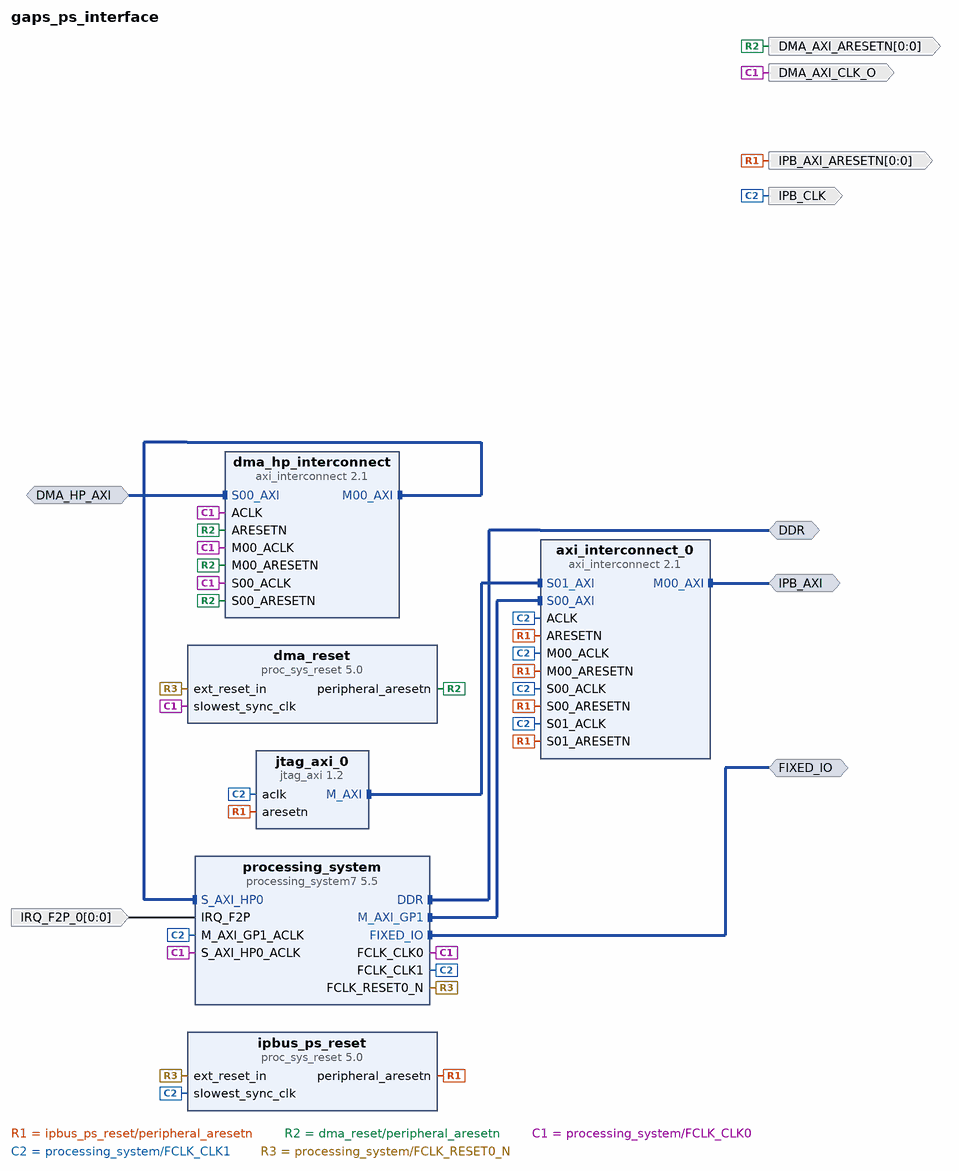
[diagram p0: block diagram of the top level]
# Vivado block design gaps_ps_interface, xc7z010clg400-1, Vivado 2020.1_AR75210
create_bd_design gaps_ps_interface

create_bd_intf_port -mode Master -vlnv xilinx.com:interface:ddrx_rtl:1.0 DDR
create_bd_intf_port -mode Slave -vlnv xilinx.com:interface:aximm_rtl:1.0 DMA_HP_AXI
set_property -dict [list \
  CONFIG.DATA_WIDTH 32 \
  CONFIG.PROTOCOL AXI4 \
  CONFIG.ID_WIDTH 6 \
  CONFIG.ADDR_WIDTH 32 \
  CONFIG.AWUSER_WIDTH 0 \
  CONFIG.ARUSER_WIDTH 0 \
  CONFIG.WUSER_WIDTH 0 \
  CONFIG.RUSER_WIDTH 0 \
  CONFIG.BUSER_WIDTH 0 \
  CONFIG.READ_WRITE_MODE READ_WRITE \
  CONFIG.HAS_BURST 1 \
  CONFIG.HAS_LOCK 1 \
  CONFIG.HAS_PROT 1 \
  CONFIG.HAS_CACHE 1 \
  CONFIG.HAS_QOS 1 \
  CONFIG.HAS_REGION 0 \
  CONFIG.HAS_WSTRB 1 \
  CONFIG.HAS_BRESP 1 \
  CONFIG.HAS_RRESP 1 \
  CONFIG.SUPPORTS_NARROW_BURST 0 \
  CONFIG.NUM_READ_OUTSTANDING 8 \
  CONFIG.NUM_WRITE_OUTSTANDING 8 \
  CONFIG.MAX_BURST_LENGTH 256 \
  CONFIG.NUM_READ_THREADS 1 \
  CONFIG.NUM_WRITE_THREADS 1 \
  CONFIG.RUSER_BITS_PER_BYTE 0 \
  CONFIG.WUSER_BITS_PER_BYTE 0 \
] [get_bd_intf_ports DMA_HP_AXI]
create_bd_intf_port -mode Master -vlnv xilinx.com:display_processing_system7:fixedio_rtl:1.0 FIXED_IO
create_bd_intf_port -mode Master -vlnv xilinx.com:interface:aximm_rtl:1.0 IPB_AXI
set_property -dict [list \
  CONFIG.DATA_WIDTH 32 \
  CONFIG.PROTOCOL AXI4LITE \
  CONFIG.ADDR_WIDTH 32 \
  CONFIG.HAS_BURST 0 \
  CONFIG.HAS_LOCK 0 \
  CONFIG.HAS_CACHE 0 \
  CONFIG.HAS_QOS 0 \
  CONFIG.HAS_REGION 0 \
  CONFIG.NUM_READ_OUTSTANDING 0 \
  CONFIG.NUM_WRITE_OUTSTANDING 0 \
] [get_bd_intf_ports IPB_AXI]
create_bd_port -dir O -from 0 -to 0 DMA_AXI_ARESETN
create_bd_port -dir O -type clk DMA_AXI_CLK_O
set_property -dict {CONFIG.ASSOCIATED_BUSIF DMA_HP_AXI} [get_bd_ports DMA_AXI_CLK_O]
create_bd_port -dir O -from 0 -to 0 -type rst IPB_AXI_ARESETN
create_bd_port -dir I -from 0 -to 0 -type intr IRQ_F2P_0
set_property -dict {CONFIG.PortWidth 1} [get_bd_ports IRQ_F2P_0]
create_bd_port -dir O -type clk IPB_CLK
set_property -dict {CONFIG.ASSOCIATED_BUSIF IPB_AXI CONFIG.ASSOCIATED_RESET IPB_AXI_ARESETN} [get_bd_ports IPB_CLK]

create_bd_cell -type ip -vlnv xilinx.com:ip:proc_sys_reset:5.0 dma_reset
create_bd_cell -type ip -vlnv xilinx.com:ip:proc_sys_reset:5.0 ipbus_ps_reset
create_bd_cell -type ip -vlnv xilinx.com:ip:processing_system7:5.5 processing_system
set_property -dict [list \
  CONFIG.PCW_APU_PERIPHERAL_FREQMHZ 666.666666 \
  CONFIG.PCW_CRYSTAL_PERIPHERAL_FREQMHZ 33.333333333333333333333333333333333 \
  CONFIG.PCW_ENET0_ENET0_IO {MIO 16 .. 27} \
  CONFIG.PCW_ENET0_GRP_MDIO_ENABLE 1 \
  CONFIG.PCW_ENET0_GRP_MDIO_IO {MIO 52 .. 53} \
  CONFIG.PCW_ENET0_PERIPHERAL_ENABLE 1 \
  CONFIG.PCW_ENET_RESET_ENABLE 0 \
  CONFIG.PCW_EN_CLK1_PORT 1 \
  CONFIG.PCW_FCLK_CLK1_BUF TRUE \
  CONFIG.PCW_FPGA0_PERIPHERAL_FREQMHZ 100 \
  CONFIG.PCW_FPGA1_PERIPHERAL_FREQMHZ 33.33333333333333333333333333333 \
  CONFIG.PCW_FPGA_FCLK1_ENABLE 1 \
  CONFIG.PCW_GP0_EN_MODIFIABLE_TXN 0 \
  CONFIG.PCW_GP1_EN_MODIFIABLE_TXN 0 \
  CONFIG.PCW_GPIO_MIO_GPIO_ENABLE 1 \
  CONFIG.PCW_GPIO_MIO_GPIO_IO MIO \
  CONFIG.PCW_I2C0_GRP_INT_ENABLE 1 \
  CONFIG.PCW_I2C0_GRP_INT_IO EMIO \
  CONFIG.PCW_I2C0_I2C0_IO {MIO 14 .. 15} \
  CONFIG.PCW_I2C0_PERIPHERAL_ENABLE 1 \
  CONFIG.PCW_I2C_PERIPHERAL_FREQMHZ 111.111115 \
  CONFIG.PCW_I2C_RESET_ENABLE 0 \
  CONFIG.PCW_IRQ_F2P_INTR 1 \
  CONFIG.PCW_PERIPHERAL_BOARD_PRESET None \
  CONFIG.PCW_PRESET_BANK0_VOLTAGE {LVCMOS 1.8V} \
  CONFIG.PCW_PRESET_BANK1_VOLTAGE {LVCMOS 1.8V} \
  CONFIG.PCW_QSPI_GRP_FBCLK_ENABLE 1 \
  CONFIG.PCW_QSPI_GRP_FBCLK_IO {MIO 8} \
  CONFIG.PCW_QSPI_GRP_SINGLE_SS_ENABLE 1 \
  CONFIG.PCW_QSPI_GRP_SINGLE_SS_IO {MIO 1 .. 6} \
  CONFIG.PCW_QSPI_PERIPHERAL_ENABLE 1 \
  CONFIG.PCW_QSPI_PERIPHERAL_FREQMHZ 125 \
  CONFIG.PCW_QSPI_QSPI_IO {MIO 1 .. 6} \
  CONFIG.PCW_SD0_GRP_CD_ENABLE 0 \
  CONFIG.PCW_SD0_GRP_WP_ENABLE 0 \
  CONFIG.PCW_SD0_PERIPHERAL_ENABLE 1 \
  CONFIG.PCW_SD0_SD0_IO {MIO 40 .. 45} \
  CONFIG.PCW_SDIO_PERIPHERAL_FREQMHZ 33.333333333333 \
  CONFIG.PCW_SINGLE_QSPI_DATA_MODE x4 \
  CONFIG.PCW_S_AXI_HP0_DATA_WIDTH 32 \
  CONFIG.PCW_TTC0_PERIPHERAL_ENABLE 1 \
  CONFIG.PCW_TTC0_TTC0_IO {MIO 30 .. 31} \
  CONFIG.PCW_UART0_PERIPHERAL_ENABLE 1 \
  CONFIG.PCW_UART0_UART0_IO {MIO 46 .. 47} \
  CONFIG.PCW_UART1_PERIPHERAL_ENABLE 0 \
  CONFIG.PCW_UART_PERIPHERAL_FREQMHZ 100 \
  CONFIG.PCW_UIPARAM_DDR_BUS_WIDTH {16 Bit} \
  CONFIG.PCW_UIPARAM_DDR_FREQ_MHZ 400 \
  CONFIG.PCW_UIPARAM_DDR_MEMORY_TYPE {DDR 3 (Low Voltage)} \
  CONFIG.PCW_UIPARAM_DDR_PARTNO {MT41K256M16 RE-125} \
  CONFIG.PCW_USB0_PERIPHERAL_ENABLE 0 \
  CONFIG.PCW_USB_RESET_ENABLE 0 \
  CONFIG.PCW_USE_FABRIC_INTERRUPT 1 \
  CONFIG.PCW_USE_M_AXI_GP0 0 \
  CONFIG.PCW_USE_M_AXI_GP1 1 \
  CONFIG.PCW_USE_S_AXI_HP0 1 \
  CONFIG.PCW_WDT_PERIPHERAL_ENABLE 1 \
  CONFIG.PCW_WDT_WDT_IO EMIO \
] [get_bd_cells processing_system]
# 499 more settings of processing_system are not shown: defaults, MIO pin electricals, DDR timing, and values the tool derives
create_bd_cell -type ip -vlnv xilinx.com:ip:jtag_axi:1.2 jtag_axi_0
set_property -dict {CONFIG.PROTOCOL 2} [get_bd_cells jtag_axi_0]
create_bd_cell -type ip -vlnv xilinx.com:ip:axi_interconnect:2.1 axi_interconnect_0
set_property -dict {CONFIG.NUM_MI 1 CONFIG.NUM_SI 2} [get_bd_cells axi_interconnect_0]
create_bd_cell -type ip -vlnv xilinx.com:ip:axi_interconnect:2.1 dma_hp_interconnect
set_property -dict [list \
  CONFIG.ENABLE_ADVANCED_OPTIONS 1 \
  CONFIG.NUM_MI 1 \
  CONFIG.NUM_SI 1 \
  CONFIG.S00_HAS_DATA_FIFO 0 \
  CONFIG.S00_HAS_REGSLICE 4 \
] [get_bd_cells dma_hp_interconnect]

# ---- connections ----

connect_bd_intf_net [get_bd_intf_ports IPB_AXI] [get_bd_intf_pins axi_interconnect_0/M00_AXI]
connect_bd_intf_net -intf_net dma_interconnect1_M00_AXI [get_bd_intf_pins dma_hp_interconnect/M00_AXI] [get_bd_intf_pins processing_system/S_AXI_HP0]
connect_bd_intf_net -intf_net processing_system7_0_FIXED_IO [get_bd_intf_ports FIXED_IO] [get_bd_intf_pins processing_system/FIXED_IO]
connect_bd_intf_net [get_bd_intf_pins jtag_axi_0/M_AXI] [get_bd_intf_pins axi_interconnect_0/S01_AXI]
connect_bd_intf_net -intf_net processing_system7_0_DDR [get_bd_intf_ports DDR] [get_bd_intf_pins processing_system/DDR]
connect_bd_intf_net -intf_net axi_protocol_convert_1_M_AXI [get_bd_intf_pins axi_interconnect_0/S00_AXI] [get_bd_intf_pins processing_system/M_AXI_GP1]
connect_bd_intf_net [get_bd_intf_ports DMA_HP_AXI] [get_bd_intf_pins dma_hp_interconnect/S00_AXI]
connect_bd_net -net IPBUS_AXI_RESETN [get_bd_pins ipbus_ps_reset/peripheral_aresetn] \
  [get_bd_pins jtag_axi_0/aresetn] [get_bd_ports IPB_AXI_ARESETN] [get_bd_pins axi_interconnect_0/ARESETN] \
  [get_bd_pins axi_interconnect_0/S00_ARESETN] [get_bd_pins axi_interconnect_0/S01_ARESETN] \
  [get_bd_pins axi_interconnect_0/M00_ARESETN]
connect_bd_net -net ARESETN_2 [get_bd_pins dma_reset/peripheral_aresetn] \
  [get_bd_ports DMA_AXI_ARESETN] [get_bd_pins dma_hp_interconnect/ARESETN] [get_bd_pins dma_hp_interconnect/S00_ARESETN] \
  [get_bd_pins dma_hp_interconnect/M00_ARESETN]
connect_bd_net -net DMA_CLK [get_bd_pins processing_system/FCLK_CLK0] \
  [get_bd_ports DMA_AXI_CLK_O] [get_bd_pins dma_reset/slowest_sync_clk] [get_bd_pins processing_system/S_AXI_HP0_ACLK] \
  [get_bd_pins dma_hp_interconnect/ACLK] [get_bd_pins dma_hp_interconnect/S00_ACLK] \
  [get_bd_pins dma_hp_interconnect/M00_ACLK]
connect_bd_net -net IPBUS_CLK [get_bd_pins processing_system/FCLK_CLK1] \
  [get_bd_pins ipbus_ps_reset/slowest_sync_clk] [get_bd_pins processing_system/M_AXI_GP1_ACLK] [get_bd_pins jtag_axi_0/aclk] \
  [get_bd_ports IPB_CLK] [get_bd_pins axi_interconnect_0/ACLK] [get_bd_pins axi_interconnect_0/S00_ACLK] \
  [get_bd_pins axi_interconnect_0/S01_ACLK] [get_bd_pins axi_interconnect_0/M00_ACLK]
connect_bd_net -net IRQ_F2P_0_1 [get_bd_ports IRQ_F2P_0] [get_bd_pins processing_system/IRQ_F2P]
connect_bd_net -net ps_reset [get_bd_pins processing_system/FCLK_RESET0_N] \
  [get_bd_pins dma_reset/ext_reset_in] [get_bd_pins ipbus_ps_reset/ext_reset_in]

# ---- address map ----
assign_bd_address -offset 0x00000000 -range 512M -target_address_space [get_bd_addr_spaces DMA_HP_AXI] [get_bd_addr_segs processing_system/S_AXI_HP0/HP0_DDR_LOWOCM]
assign_bd_address -offset 0x90000000 -range 64K -target_address_space [get_bd_addr_spaces jtag_axi_0/Data] [get_bd_addr_segs IPB_AXI/Reg]
assign_bd_address -offset 0x80000000 -range 64K -target_address_space [get_bd_addr_spaces processing_system/Data] [get_bd_addr_segs IPB_AXI/Reg]

validate_bd_design
save_bd_design
